# Altium schematic sheet EFR32xG22_ESL-Node_Ref-Des_Sheet1.SchDoc: EFR32BG22, Buttons, Flash, Headers
size A3; Organization: Altium Limited; Revision: A02; SheetNumber: 1; SheetTotal: 2
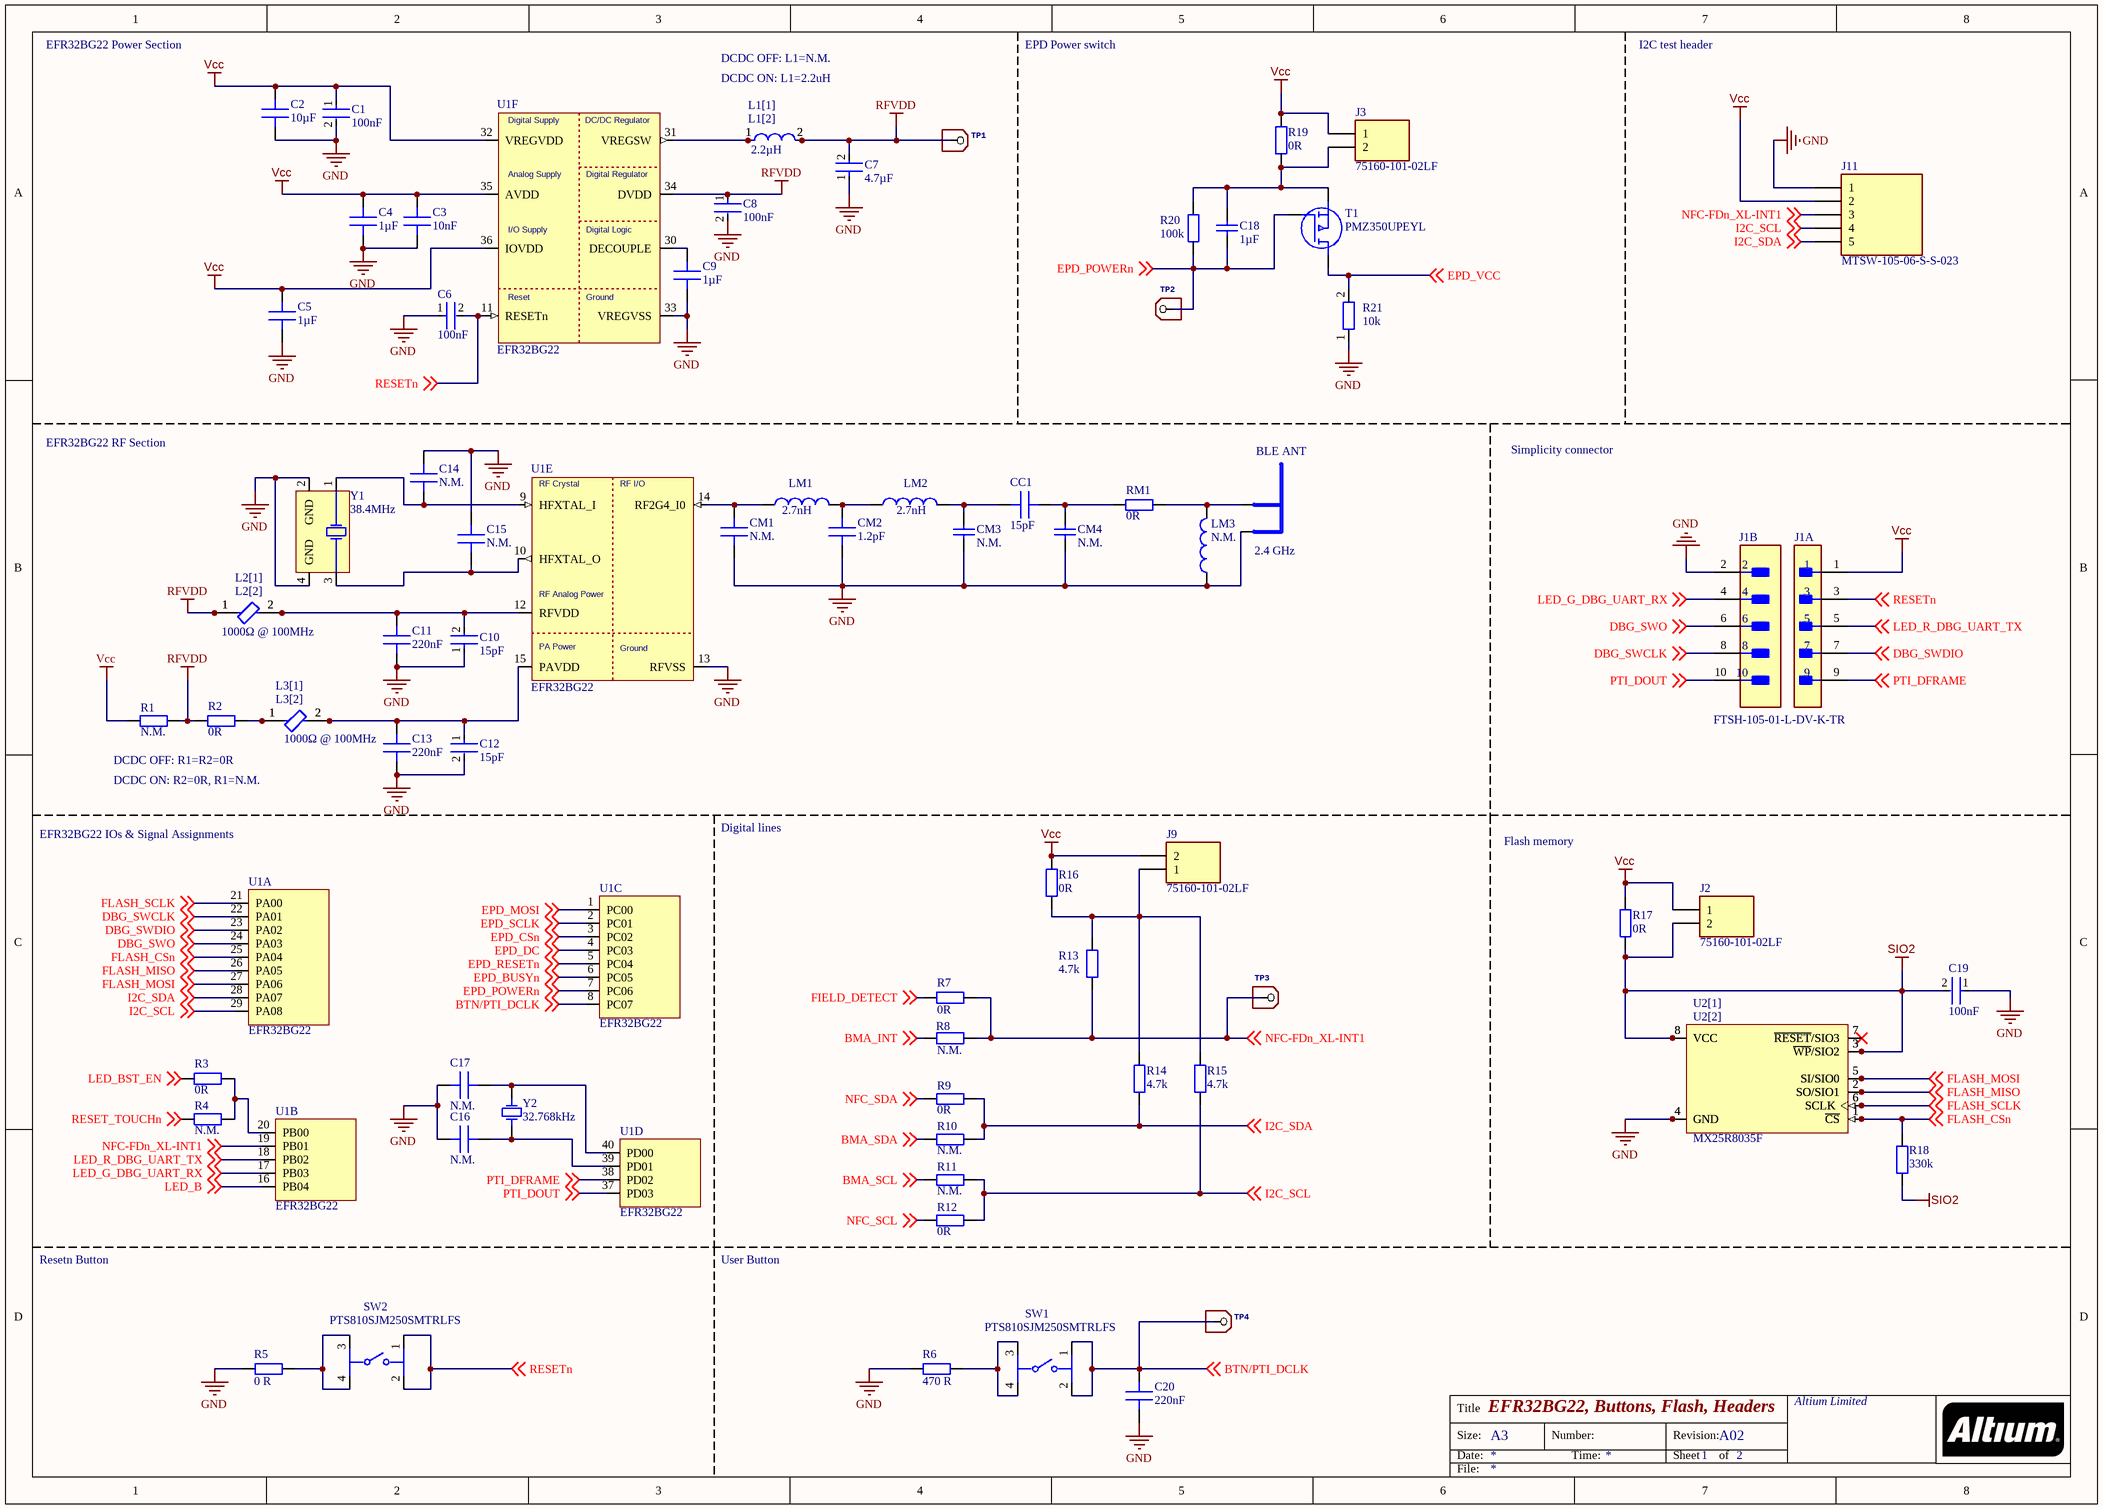
[diagram p0: EFR32xG22_ESL-Node_Ref-Des_Sheet1.SchDoc]

## Parts
BLE_ANT  2.4 GHz  [RF_ANTENNA_INVERTED_F]
C1  100nF  [0201]
C2  value 10µF  [0402]  (hidden comment: CAP CER 0402 X5R 10uF 10V 20%)
C3  value 10nF  [0201]  (hidden comment: CAP CER 0201 X7R 10nF 10V 10%)
C4  value 1µF  [0402]  (hidden comment: CAP CER 0402 X7R 1uF 6.3V 10%)
C5  value 1µF  [0201]  (hidden comment: GRM033C81A105ME05D)
C6  100nF  [0201]
C7  4.7µF  [0402]
C8  100nF  [0201]
C9  value 1µF  [0201]  (hidden comment: GRM033C81A105ME05D)
C10  15pF  [0201]
C11  value 220nF  [0201]  (hidden comment: CAP CER 1000PF 10V X7R 0201 10%)
C12  15pF  [0201]
C13  value 220nF  [0201]  (hidden comment: CAP CER 1000PF 10V X7R 0201 10%)
C14  value N.M.  [0201]  (hidden comment: CAP CER 0201 C0G 1.2pF 50V 0.05pF)
C15  value N.M.  [0201]  (hidden comment: CAP CER 0201 C0G 1.2pF 50V 0.05pF)
C16  value N.M.  [0201]  (hidden comment: CAP CER 0201 C0G 1.2pF 50V 0.05pF)
C17  value N.M.  [0201]  (hidden comment: CAP CER 0201 C0G 1.2pF 50V 0.05pF)
C18  1µF  [0402]
C19  100nF  [0201]
C20  value 220nF  [0201]  (hidden comment: CAP CER 1000PF 10V X7R 0201 10%)
CC1  value 15pF  [0201_300ER]  (hidden comment: CAP CER 0201 NP0 18pF 25V 2%)
CM1  value N.M.  [0201_300ER]  (hidden comment: CAP CER 0201 C0G 1.2pF 50V 0.05pF)
CM2  value 1.2pF  [0201_300ER]  (hidden comment: CAP CER 0201 C0G 1.3pF 25V 0.05pF)
CM3  N.M.  [0201_300ER]
CM4  N.M.  [0201_300ER]
J1  FTSH-105-01-L-DV-K-TR  [FTSH_105_01_L_DV_K]  (value not drawn)  (parts A,B of 2)
J2  75160-101-02LF  [Jumper_HDR_2.54mm]
J3  75160-101-02LF  [Jumper_HDR_2.54mm]
J9  75160-101-02LF  [Jumper_HDR_2.54mm]
J11  MTSW-105-06-S-S-023  [Jumper_HDR_2.54mm_5p]
L1[1]  2.2µH  [0805]  (value not drawn)
L1[2]  2.2µH  [0603]
L2[1]  1000Ω @ 100MHz  [0402]
L2[2]  1000Ω @ 100MHz  [0603]  (value not drawn)
L3[1]  1000Ω @ 100MHz  [0402]
L3[2]  1000Ω @ 100MHz  [0603]  (value not drawn)
LM1  value 2.7nH  [0201_300ER]  (hidden comment: LQP03HQ2N6B02)
LM2  value 2.7nH  [0201_300ER]  (hidden comment: IND Fixed 0201 1.5nH 1A 50mOhm 0.05nH)
LM3  value N.M.  [0201_300ER]  (hidden comment: IND Fixed 0201 1.5nH 1A 50mOhm 0.05nH)
R1  N.M.  [0201]
R2  0R  [0201]
R3  0R  [0603]
R4  N.M.  [0603]
R5  value 0 R  [0201]  (hidden comment: RES 0201 100R 1/20W 1% 200ppm)
R6  value 470 R  [0201]  (hidden comment: RES 0201 100R 1/20W 1% 200ppm)
R7  0R  [0402]
R8  N.M.  [0402]
R9  0R  [0402]
R10  N.M.  [0402]
R11  N.M.  [0402]
R12  0R  [0402]
R13  4.7k  [0201]
R14  4.7k  [0201]
R15  4.7k  [0201]
R16  0R  [0603]
R17  0R  [0603]
R18  value 330k  [0201]  (hidden comment: RES 0201 330K 1/20W 1%)
R19  0R  [0603]
R20  100k  [0201]
R21  10k  [0201]
RM1  0R  [0201]
SW1  PTS810SJM250SMTRLFS  [SW_CK_PTS810]
SW2  PTS810SJM250SMTRLFS  [SW_CK_PTS810]
T1  PMZ350UPEYL  [SOT883_B_FIXED]
TP1  TPSMDR1  [TP_RPAD1]  (value not drawn)
TP2  TPSMDR1  [TP_RPAD1]  (value not drawn)
TP3  TPSMDR1  [TP_RPAD1]  (value not drawn)
TP4  TPSMDR1  [TP_RPAD1]  (value not drawn)
U1  value EFR32BG22  [QFN-40_EFR32]  (hidden comment: EFR32XG22)  (parts A,B,C,D,E,F of 6)
U2[1]  value MX25R8035F  [SOP8_127P600X175-8N_150mil]  (hidden comment: MX25R8035FZUIL0)
U2[2]  MX25R8035FZUIL0  [SOP8_127P790X216-8N_200mil]  (value not drawn)
Y1  value 38.4MHz  [XTAL_DSX211SH_4]  (hidden comment: DSX211SH 1ZZNAE38400AB0A)
Y2  value 32.768kHz  [XTAL_DST1610A]  (hidden comment: CM8V-T1A-32.768KHZ-7PF-20PPM-TA-QC)

## Nets
GND: BLE_ANT.2(GND) C1.2 C2.1 C3.2 C4.1 C5.2 C6.1 C7.1 C8.2 C9.1 C10.1 C11.2 C12.2 C13.2 C14.2 C15.2 C16.2 C17.2 C19.1 C20.2 CM1.2 CM2.2 CM3.2 CM4.2 J1.2 J11.1 LM3.1 R5.2 R6.2 R21.1 U1.13(RFVSS) U1.33(VREGVSS) U2[1].4(GND) U2[2].4(GND) Y1.2(GND) Y1.4(GND)
RFVDD: C7.2 C8.1 L1[1].2 L1[2].2 L2[1].1 L2[2].1 R1.1 R2.1 TP1.P$1 U1.34(DVDD)
SIO2: C19.2 J2.2 R17.1 R18.2 U2[1].3(~{WP}/SIO2) U2[1].8(VCC) U2[2].3(~{WP}/SIO2) U2[2].8(VCC)
Vcc: C1.1 C2.2 C3.1 C4.2 C5.1 J1.1 J2.1 J3.1 J9.2 J11.2 R1.2 R16.2 R17.2 R19.2 U1.32(VREGVDD) U1.35(AVDD) U1.36(IOVDD)
BMA_INT: R8.1 ; off-sheet BMA_INT
BMA_SCL: R11.2 ; off-sheet BMA_SCL
BMA_SDA: R10.2 ; off-sheet BMA_SDA
BTN/PTI_DCLK: C20.1 SW1.1 SW1.2 TP4.P$1 U1.8(PC07) ; off-sheet BTN/PTI_DCLK
DBG_SWCLK: J1.8 U1.22(PA01) ; off-sheet DBG_SWCLK
DBG_SWDIO: J1.7 U1.23(PA02) ; off-sheet DBG_SWDIO
DBG_SWO: J1.6 U1.24(PA03) ; off-sheet DBG_SWO
EPD_BUSYn: U1.6(PC05) ; off-sheet EPD_BUSYn
EPD_CSn: U1.3(PC02) ; off-sheet EPD_CSn
EPD_DC: U1.4(PC03) ; off-sheet EPD_DC
EPD_MOSI: U1.1(PC00) ; off-sheet EPD_MOSI
EPD_POWERn: C18.2 R20.1 T1.G TP2.P$1 U1.7(PC06) ; off-sheet EPD_POWERn
EPD_RESETn: U1.5(PC04) ; off-sheet EPD_RESETn
EPD_SCLK: U1.2(PC01) ; off-sheet EPD_SCLK
EPD_VCC: R21.2 T1.D ; off-sheet EPD_VCC
FIELD_DETECT: R7.2 ; off-sheet FIELD_DETECT
FLASH_CSn: R18.1 U1.25(PA04) U2[1].1(~{CS}) U2[2].1(~{CS}) ; off-sheet FLASH_CSn
FLASH_MISO: U1.26(PA05) U2[1].2(SO/SIO1) U2[2].2(SO/SIO1) ; off-sheet FLASH_MISO
FLASH_MOSI: U1.27(PA06) U2[1].5(SI/SIO0) U2[2].5(SI/SIO0) ; off-sheet FLASH_MOSI
FLASH_SCLK: U1.21(PA00) U2[1].6(SCLK) U2[2].6(SCLK) ; off-sheet FLASH_SCLK
I2C_SCL: J11.4 R11.1 R12.1 R15.1 U1.29(PA08) ; off-sheet I2C_SCL
I2C_SDA: J11.5 R9.1 R10.1 R14.1 U1.28(PA07) ; off-sheet I2C_SDA
LED_B: U1.16(PB04) ; off-sheet LED_B
LED_BST_EN: R3.1 ; off-sheet LED_BST_EN
LED_G_DBG_UART_RX: J1.4 U1.17(PB03) ; off-sheet LED_G_DBG_UART_RX
LED_R_DBG_UART_TX: J1.5 U1.18(PB02) ; off-sheet LED_R_DBG_UART_TX
NFC-FDn_XL-INT1: J11.3 R7.1 R8.2 R13.1 TP3.P$1 U1.19(PB01) ; off-sheet NFC-FDn_XL-INT1
NFC_SCL: R12.2 ; off-sheet NFC_SCL
NFC_SDA: R9.2 ; off-sheet NFC_SDA
PTI_DFRAME: J1.9 U1.38(PD02) ; off-sheet PTI_DFRAME
PTI_DOUT: J1.10 U1.37(PD03) ; off-sheet PTI_DOUT
RESET_TOUCHn: R4.2 ; off-sheet RESET_TOUCHn
RESETn: C6.2 J1.3 SW2.1 SW2.2 U1.11(RESETn) ; off-sheet RESETn
NetBLE_ANT_1: BLE_ANT.1(ANT) LM3.2 RM1.2
NetC9_2: C9.2 U1.30(DECOUPLE)
NetC10_2: C10.2 C11.1 L2[1].2 L2[2].2 U1.12(RFVDD)
NetC12_1: C12.1 C13.1 L3[1].2 L3[2].2 U1.15(PAVDD)
NetC14_1: C14.1 U1.9(HFXTAL_I) Y1.1(X1)
NetC15_1: C15.1 U1.10(HFXTAL_O) Y1.3(X2)
NetC16_1: C16.1 U1.39(PD01) Y2.1
NetC17_1: C17.1 U1.40(PD00) Y2.2
NetC18_1: C18.1 J3.2 R19.1 R20.2 T1.S
NetCC1_1: CC1.1 CM3.1 LM2.2
NetCC1_2: CC1.2 CM4.1 RM1.1
NetCM1_1: CM1.1 LM1.1 U1.14(RF2G4_I0)
NetCM2_1: CM2.1 LM1.2 LM2.1
NetJ9_1: J9.1 R13.2 R14.2 R15.2 R16.1
NetL1[1]_1: L1[1].1 L1[2].1 U1.31(VREGSW)
NetL3[1]_1: L3[1].1 L3[2].1 R2.2
NetR3_2: R3.2 R4.1 U1.20(PB00)
NetR5_1: R5.1 SW2.3 SW2.4
NetR6_1: R6.1 SW1.3 SW1.4
NetU2[1]_7: U2[1].7(~{RESET}/SIO3) U2[2].7(~{RESET}/SIO3)

## Notes on the sheet
- EFR32BG22 Power Section
- EPD Power switch
- I2C test header
- DCDC OFF: L1=N.M.
- DCDC ON: L1=2.2uH
- EFR32BG22 RF Section
- Simplicity connector
- DCDC OFF: R1=R2=0R
- DCDC ON: R2=0R, R1=N.M.
- EFR32BG22 IOs & Signal Assignments
- Digital lines
- Flash memory
- Resetn Button
- User Button
- Title
- Size:
- Date:
- A3
- Number:
- Time:
- Revision:
- Sheet
- of
- File:
- (in symbol EFR32XG22, part E) RF Crystal; RF I/O; RF Analog Power; PA Power; Ground
- (in symbol EFR32XG22, part F) Digital Supply; DC/DC Regulator; Analog Supply; Digital Regulator; I/O Supply; Digital Logic; Reset; Ground

## Library data of the parts
BLE_ANT = ANT_INVERTED_F: PCB Footprint: EM358x_INVERTED_F
C1 C6 C8 C19 = CMP-06035-000062-2: Chip Multilayer Ceramic Capacitors for General Purpose, 0201, 0.10uF, X5R, 15%, 10%, 6.3V; Min Operating Temperature: -55°C; Lead Free: Lead Free; Radiation Hardening: No; Dielectric: X5R; Voltage Rating (DC): 6.3V; REACH SVHC: No SVHC; Case/Package: 0201; Voltage Rating: 6.3V; Length: 0.6mm; Max Operating Temperature: 85°C; Width: 0.012inch; Depth: 0.3mm; Material: Ceramic; Case Code (Metric): 0603; Thickness: 0.013inch; Packaging: Tape and Reel; Height: 0.3mm; Capacitance: 100nF; Weight: 6E-06oz; Package Quantity: 1; Mount: Surface Mount; Voltage: 6.3V; Case Code (Imperial): 0201; Tolerance: 10%; Termination: SMD/SMT
C2 = CMP-120-00104-A.01: SubCategory Tag: Ceramic; RoHS: Compliant; Material: X5R; Mount: SMD; Rating: 10V; Package: 0402; Tolerance: 20%; Max Operating Temp: 85°C; Min Operating Temp: -55°C
C3 = CMP-120-00000-A.11: SubCategory Tag: Ceramic; Rating: 10V; Tolerance: 10%; Min Operating Temp: -55°C; RoHS: Compliant; Max Operating Temp: 85°C; Material: X7R; Package: 0201; Mount: SMD
C4 = CMP-120-00029-A.01: SubCategory Tag: Ceramic; Material: X7R; Min Operating Temp: -55°C; Package: 0402; Rating: 6.3V; Mount: SMD; Tolerance: 10%; RoHS: Compliant; Max Operating Temp: 125°C
C5 C9 = CMP-120-00040-A.03: CAP CER 0201 X6S 1uF 10V 20%; Manufacturer: Murata; SubCategory Tag: Ceramic; Min Operating Temp: -55°C; Rating: 10V; Package: 0201; Manufacturer PN: GRM033C81A105ME05D; Max Operating Temp: 105°C; Tolerance: 20%; Material: X6S; Mount: SMD; RoHS: Compliant
C7 = CMP-2008-04549-2: Chip Multilayer Ceramic Capacitors for General Purpose, 0402, 4.7uF, X5R, 15%, 20%, 6.3V; Height: 0.5mm; Weight: 0.000212oz; Length: 1mm; Case Code (Metric): 1005; Packaging: Tape and Reel; Termination: SMD/SMT; Dielectric: X5R; Depth: 0.5mm; Case Code (Imperial): 0402; Min Operating Temperature: -55°C; Case/Package: 0402; Voltage: 6.3V; Width: 0.02inch; Capacitance: 4.7uF; Lead Free: Lead Free; Thickness: 0.022inch; Contact Plating: Tin; REACH SVHC: No SVHC; Package Quantity: 10000; Tolerance: 20%; Voltage Rating (DC): 6.3V; Voltage Rating: 6.3V; Mount: Surface Mount; Max Operating Temperature: 85°C
C10 C12 = CMP-2010-01505-2: Chip Multilayer Ceramic Capacitors for General Purpose, 0201, 15pF, C0G, 30ppm/°C, 5%, 50V; Voltage: 50V; Lead Free: Lead Free; Package Quantity: 1; Length: 0.6mm; Max Operating Temperature: 125°C; Height: 0.3mm; Tolerance: 5%; Termination: SMD/SMT; Case Code (Metric): 0603; Voltage Rating (DC): 50V; Radiation Hardening: No; Mount: Surface Mount; Case Code (Imperial): 0201; Thickness: 0.013inch; Case/Package: 0201; REACH SVHC: No SVHC; Width: 0.012inch; Dielectric: C0G; Min Operating Temperature: -55°C; Packaging: Tape and Reel; Capacitance: 15pF; Depth: 0.3mm; Voltage Rating: 50V
C11 C13 C20 = CMP-120-00038-A.01: SubCategory Tag: Ceramic; Min Operating Temp: -55°C; RoHS: Compliant; Mount: SMD; Rating: 10V; Tolerance: 10%; Package: 0201; Material: X7R; Max Operating Temp: 125°C
C14-C17 CM1 = CMP-120-00031-A.02: SubCategory Tag: Ceramic; Min Operating Temp: -55°C; Package: 0201; Mount: SMD; Max Operating Temp: 125°C; Rating: 50V; RoHS: Compliant; Material: C0G; Tolerance: 0.05pF
C18 = CMP-2000-06336-1: Chip Capacitor, 1 uF, +/- 10%, 10 V, -55 to 85 degC, 0603 (1608 Metric), RoHS, Tape and Reel; Manufacturer: Murata; Dielectric: X5R; Voltage Rating: 10V; Case Height: 0.8mm; Temperature Coefficient / Code: +/-15%; Type: GeneralPurposeMLCC; Brand: MurataElectronics; Capacitance: 1uF; Case Length: 1.6mm; Capacitance - nF: 1000nF; Package Description: 2-Pin Surface Mount Device, Body 1.6 x 0.8 mm; Maximum Operating Temperature: +85C; Minimum Operating Temperature: -55C; Mounting Technology: SurfaceMount; RoHS: Details; Package Reference: 0603; Product: GeneralTypeMLCCs; Packaging: Reel; Case Code - mm: 1608; Manufacturer URL: http://www.murata.com/; Dimensions: 0.8mmWx1.6mmLx0.8mmH; Factory Pack Quantity: 4000; Case Code - in: 0603; Tolerance: 10%; Product Category: MultilayerCeramicCapacitorsMLCC-SMD/SMT; Series: GRM; Datasheet Version: 02/2016; Case Width: 0.8mm; Operating Temperature Range: -55Cto+85C; Datasheet URL: http://search.murata.co.jp/Ceramy/image/img/A01X/G101/ENG/GRM188R61A105KA61-01.pdf; Package / Case: 0603(1608metric); Termination Style: SMD/SMT; Voltage Rating DC: 10V
CC1 = CMP-120-00037-A.02: SubCategory Tag: Ceramic; Mount: SMD; RoHS: Compliant; Tolerance: 2%; Rating: 25V; Min Operating Temp: -55°C; Max Operating Temp: 125°C; Package: 0201; Material: COG
CM2 = CMP-120-00033-A.02: SubCategory Tag: Ceramic; Tolerance: 0.05pF; Material: C0G; Mount: SMD; Max Operating Temp: 125°C; Min Operating Temp: -55°C; Package: 0201; RoHS: Compliant; Rating: 25V
CM3 CM4 = CMP-1033-00061-2: Part Number: 02013A1R5CAT2A; Manufacturer: AVX Interconnect / Elco
J1 = CMP-2000-06293-2: CONN HEADER SMD 10POS 1.27MM; Max Current Rating: 1.75A; Number of Contacts: 10; Gender: Male; Row Spacing: 0.05inch; Connector Type: Male Pin; Housing Color: Black; Min Operating Temperature: -55°C; Depth: 3.43mm; Color: Black; Contact Plating: Gold; REACH SVHC: No SVHC; Packaging: Tape and Reel; Current Rating: 1.75A; Radiation Hardening: No; Package Quantity: 550; Number of Positions: 10; Max Operating Temperature: 125°C; Orientation: Straight; Termination: Solder; Contact Mating Length: 0.12inch; Number of Rows: 2; Lead Free: Lead Free; Contact Material: Bronze; Mount: Surface Mount; Housing Material: Polymer; Pitch: 1.27mm; Length: 6.35mm
J2 J3 J9 = HTSW-102-28-F-S: HEADER, 2.54MM, VERTICAL THOUGH HOLE, 2 POSITION; Connector Systems:Board-to-Board; Pitch Spacing:2.54mm; No. of Rows:1Rows; No. of Contacts:2Contacts; Contact Termination Type:Through Hole; Product Range:HTSW Series; Gender:Header RoHS Compliant: Yes; MP: HTSW10228FS; MF: Samtec; Package: None; Price: None; Purchase-URL: https://pricing.snapeda.com/search/part/HTSW10228FS/?ref=eda; Availability: In Stock; Value: *; Check_prices: https://www.snapeda.com/parts/HTSW10228FS/Samtec/view-part/?ref=eda; SnapEDA_Link: https://www.snapeda.com/parts/HTSW10228FS/Samtec/view-part/?ref=snap
L1[1] L1[2] = CMP-06042-016317-1: Multilayer Type Inductor for Power Lines, 0805 (2012), 2.2μH, 30%, 0.288Ω, 0.8A; Test Frequency: 1MHz; Shielding: Shielded; Current Rating: 800mA; Self Resonant Frequency: 40MHz; Core Material: Ferrite; Inductance: 2.2uH; DC Resistance (DCR): 288mR; RoHS Compliant: Yes; REACH SVHC: No SVHC; Inductance Tolerance: 30%; Package Quantity: 4000; Military Standard: Not; Max Operating Temperature: 125°C; Radiation Hardening: No; Series: LQM; Height - Seated (Max): 0.039inch; Tolerance: 30%; Height: 0.9mm; Lead Free: Lead Free; Case Code (Metric): 2012; Packaging: Tape and Reel; Termination: SMD/SMT; Case Code (Imperial): 0805; Min Operating Temperature: -55°C; Depth: 1.4mm; Mount: Surface Mount; Length: 2mm; DC Current: 800mA; Case/Package: 0805; Max DC Current: 800mA; Width: 0.049inch
L2[1] L2[2] L3[1] L3[2] = CMP-0686-00457-3: Chip Ferrite Bead, 0603, 1000Ω @ 100MHz, 0.5Ω, 25%, 450mA; Number of Circuits: 1; Max DC Current: 400mA; Shielding: Unshielded; DC Resistance (DCR): 500mR; Material: Steel; DC Resistance-Max: 700mR; Impedance: 1kR; Case Code (Imperial): 0603; Max Current Rating: 400mA; Frequency: 100MHz; Min Operating Temperature: -55°C; Case/Package: 0603; Depth: 0.8mm; Lead Free: Lead Free; Core Material: Ferrite; Current Rating: 400mA; Resistance: 500mR; Case Code (Metric): 1608; DC Current: 400mA; Package Quantity: 1; Packaging: Tape and Reel; Width: 0.8mm; Military Standard: Not; Height: 0.8mm; Series: BLM18A; Max Operating Temperature: 125°C; Tolerance: 25%; Termination: SMD/SMT; Test Frequency: 100MHz; Number of Lines: 1; Number of Pins: 2; REACH SVHC: No SVHC; Length: 1.6mm; Radiation Hardening: No
LM1 = CMP-155-00023-A.03: IND FIXED 0201 2.6nH 600mA 0.12Ohm ±0.1nH; Manufacturer: Murata; DC Resistance: 0.12; Shielding: Not shielded; RoHS: Compliant; Tolerance: 0.1nH; SubCategory Tag: Fixed; Manufacturer PN: LQP03HQ2N6B02; Max Operating Temp: 125°C; Rating: 600mA; Package: 0201; Mount: SMD; Min Operating Temp: -55°C
LM2 LM3 = CMP-155-00007-A.02: Shielding: Not shielded; DC Resistance: 50m; Rating: 1A; Tolerance: 0.05nH; Min Operating Temp: -55°C; RoHS: Compliant; Max Operating Temp: 125°C; Package: 0201; Mount: SMD; SubCategory Tag: Fixed
R1-R4 R16 R17 R19 RM1 = CMP-1012-00001-2: Manufacturer: Vishay Dale; Part Number: CRCW06030000Z0EC
R5 R6 = CMP-180-00121-A.01: Rating: 50mW; SubCategory Tag: Thick Film; Package: 0201; Mount: SMD; Min Operating Temp: -55°C; Max Operating Temp: 155°C; RoHS: Compliant; Tolerance: 1%
R7-R12 = CMP-2002-08060-1: Manufacturer: Yageo / Phycomp; Part Number: RC0402JR-130RL
R13-R15 = CMP-1010-00090-1: 4K7 0.05W 5% 0201 (0603 Metric)  SMD; Value: 4700.00 Ohm; Case-Metric: 0603; Technology: SMT; Case-EIA: 0201; Power: 0.05 W; Tolerance: 5 %
R18 = CMP-180-00036-A.02: Rating: 50mW; SubCategory Tag: Thick Film; Mount: SMD; Max Operating Temp: 155°C; Package: 0201; Min Operating Temp: -55°C; RoHS: Compliant; Tolerance: 1%
R20 = CMP-1010-00642-1: 100K 0.05W 1% 0201 (0603 Metric)  SMD; Value: 100000.00 Ohm; Case-Metric: 0603; Technology: SMT; Power: 0.05 W; Case-EIA: 0201; Tolerance: 1 %
R21 = CMP-03412-037826-1: RES SMD 10K OHM 5% 1/20W 0201; Voltage Rating: 25V; Max Power Dissipation: 50mW; Temperature Coefficient: 200ppm/°C; Resistance: 10kR; Min Operating Temperature: -55°C; Packaging: Tape and Reel; Tolerance: 5%; Length: 0.6mm; Contact Plating: Tin; Features: Moisture Resistant; Radiation Hardening: No; Military Standard: Not; Voltage Rating (DC): 25V; Termination: SMD/SMT; Size Code: 0201; Resistance Tolerance: 5%; Case Code (Imperial): 0201; Resistor Type: Thick Film; Depth: 0.3mm; Series: RC; Lead Free: Lead Free; Power Rating: 50mW; Number of Terminations: 2; Case Code (Metric): 0603; RoHS Compliant: Yes; Max Operating Temperature: 125°C; Construction: Rectangular; Case/Package: 0201
SW1 SW2 = CMP-10040-000001-2: SWITCH TACTILE SPST-NO 0.05A 16V; Throw Configuration: SPST; Operating Force: 160gf; Actuator Type: Standard; Switch Travel: 0.15mm; Switch Function: Off-Mom; Max Current Rating: 50mA; Mechanical Life: 150000Cycles; Illumination Type: Non-Illuminated; Package Quantity: 2900; Depth: 4.6mm; Mount: Surface Mount; Packaging: Tape and Reel; Length: 3.2mm; RoHS Compliant: Yes; Case/Package: SMD/SMT; Voltage Rating (DC): 16V; Min Operating Temperature: -40°C; Termination: J-Bend; Lead Free: Lead Free; Contact Plating: Silver; Orientation: Straight; Max Operating Temperature: 85°C; Current Rating: 50mA; Color: Black
T1 = PMZ350UPEYL: P-Channel 20V 1A (Ta) 360mW (Ta), 3.125W (Tc) Surface Mount DFN1006-3; MF: Nexperia USA; Availability: In Stock; Price: None; Package: DFN1006-3-3 Nexperia; MP: PMZ350UPEYL; Value: *; SnapEDA_Link: https://www.snapeda.com/parts/PMZ350UPEYL/Nexperia/view-part/?ref=snap; Check_prices: https://www.snapeda.com/parts/PMZ350UPEYL/Nexperia/view-part/?ref=eda; Purchase-URL: https://pricing.snapeda.com/search/part/PMZ350UPEYL/?ref=eda
TP1-TP4 = TPSMDR1: Testpoint
U1 = EFR32XG22: IC RF SoC 2G4+SUBG 32bit 1024kB FLASH QFN40; Manufacturer: Silicon Labs; SubCategory Tag: Embedded; Voltage: 3.8V; Additional Search Tag: SoC Wireless; Mount: SMD; Min Operating Temp: 125°C; RoHS: Compliant; Max Operating Temp: -40°C; Manufacturer PN: EFR32XG22; Package: QFN40
U2[1] U2[2] = CMP-150-00010-A.07: IC FLASH 8MBIT SPI/QUAD USON; Manufacturer: Macronix; SubCategory Tag: Memory; Voltage: 3.6V; Manufacturer PN: MX25R8035FZUIL0; Package: 8-USON; Additional Search Tag: Flash; RoHS: Compliant; Max Operating Temp: 85°C; Mount: SMD; Min Operating Temp: -40°C
  U2[2]: Value: MX25R8035F
Y1 = XTAL-1-3-4P: CRYSTAL 2.0X1.6mm 38.4MHz 10pF 20ppm; Manufacturer: KDS; SubCategory Tag: XTAL; Tolerance: 20ppm; Max Operating Temp: 105°C; Manufacturer PN: DSX211SH 1ZZNAE38400AB0A; RoHS: Compliant; Package: 2.0X1.6mm; Min Operating Temp: -40°C; Mount: SMD
Y2 = XTAL-2P: CRYSTAL 2.0x1.2mm 32.768kHz 7pF 20ppm; Manufacturer: Micro Crystal; SubCategory Tag: XTAL; RoHS: Compliant; Package: 2.0x1.2mm; Mount: SMD; Tolerance: 20ppm; Max Operating Temp: 85°C; Manufacturer PN: CM8V-T1A-32.768KHZ-7PF-20PPM-TA-QC; Min Operating Temp: -40°C
J11 = MTSW-105-06-S-S-023: Value: *; MP: MTSW-105-06-S-S-023; Availability: Unavailable; Price: None; Design Item ID: MTSW-105-06-S-S-023; Source: MTSW-105-06-S-S-023.SchLib; Package: None